# Altium schematic sheet Top.SchDoc
size A3
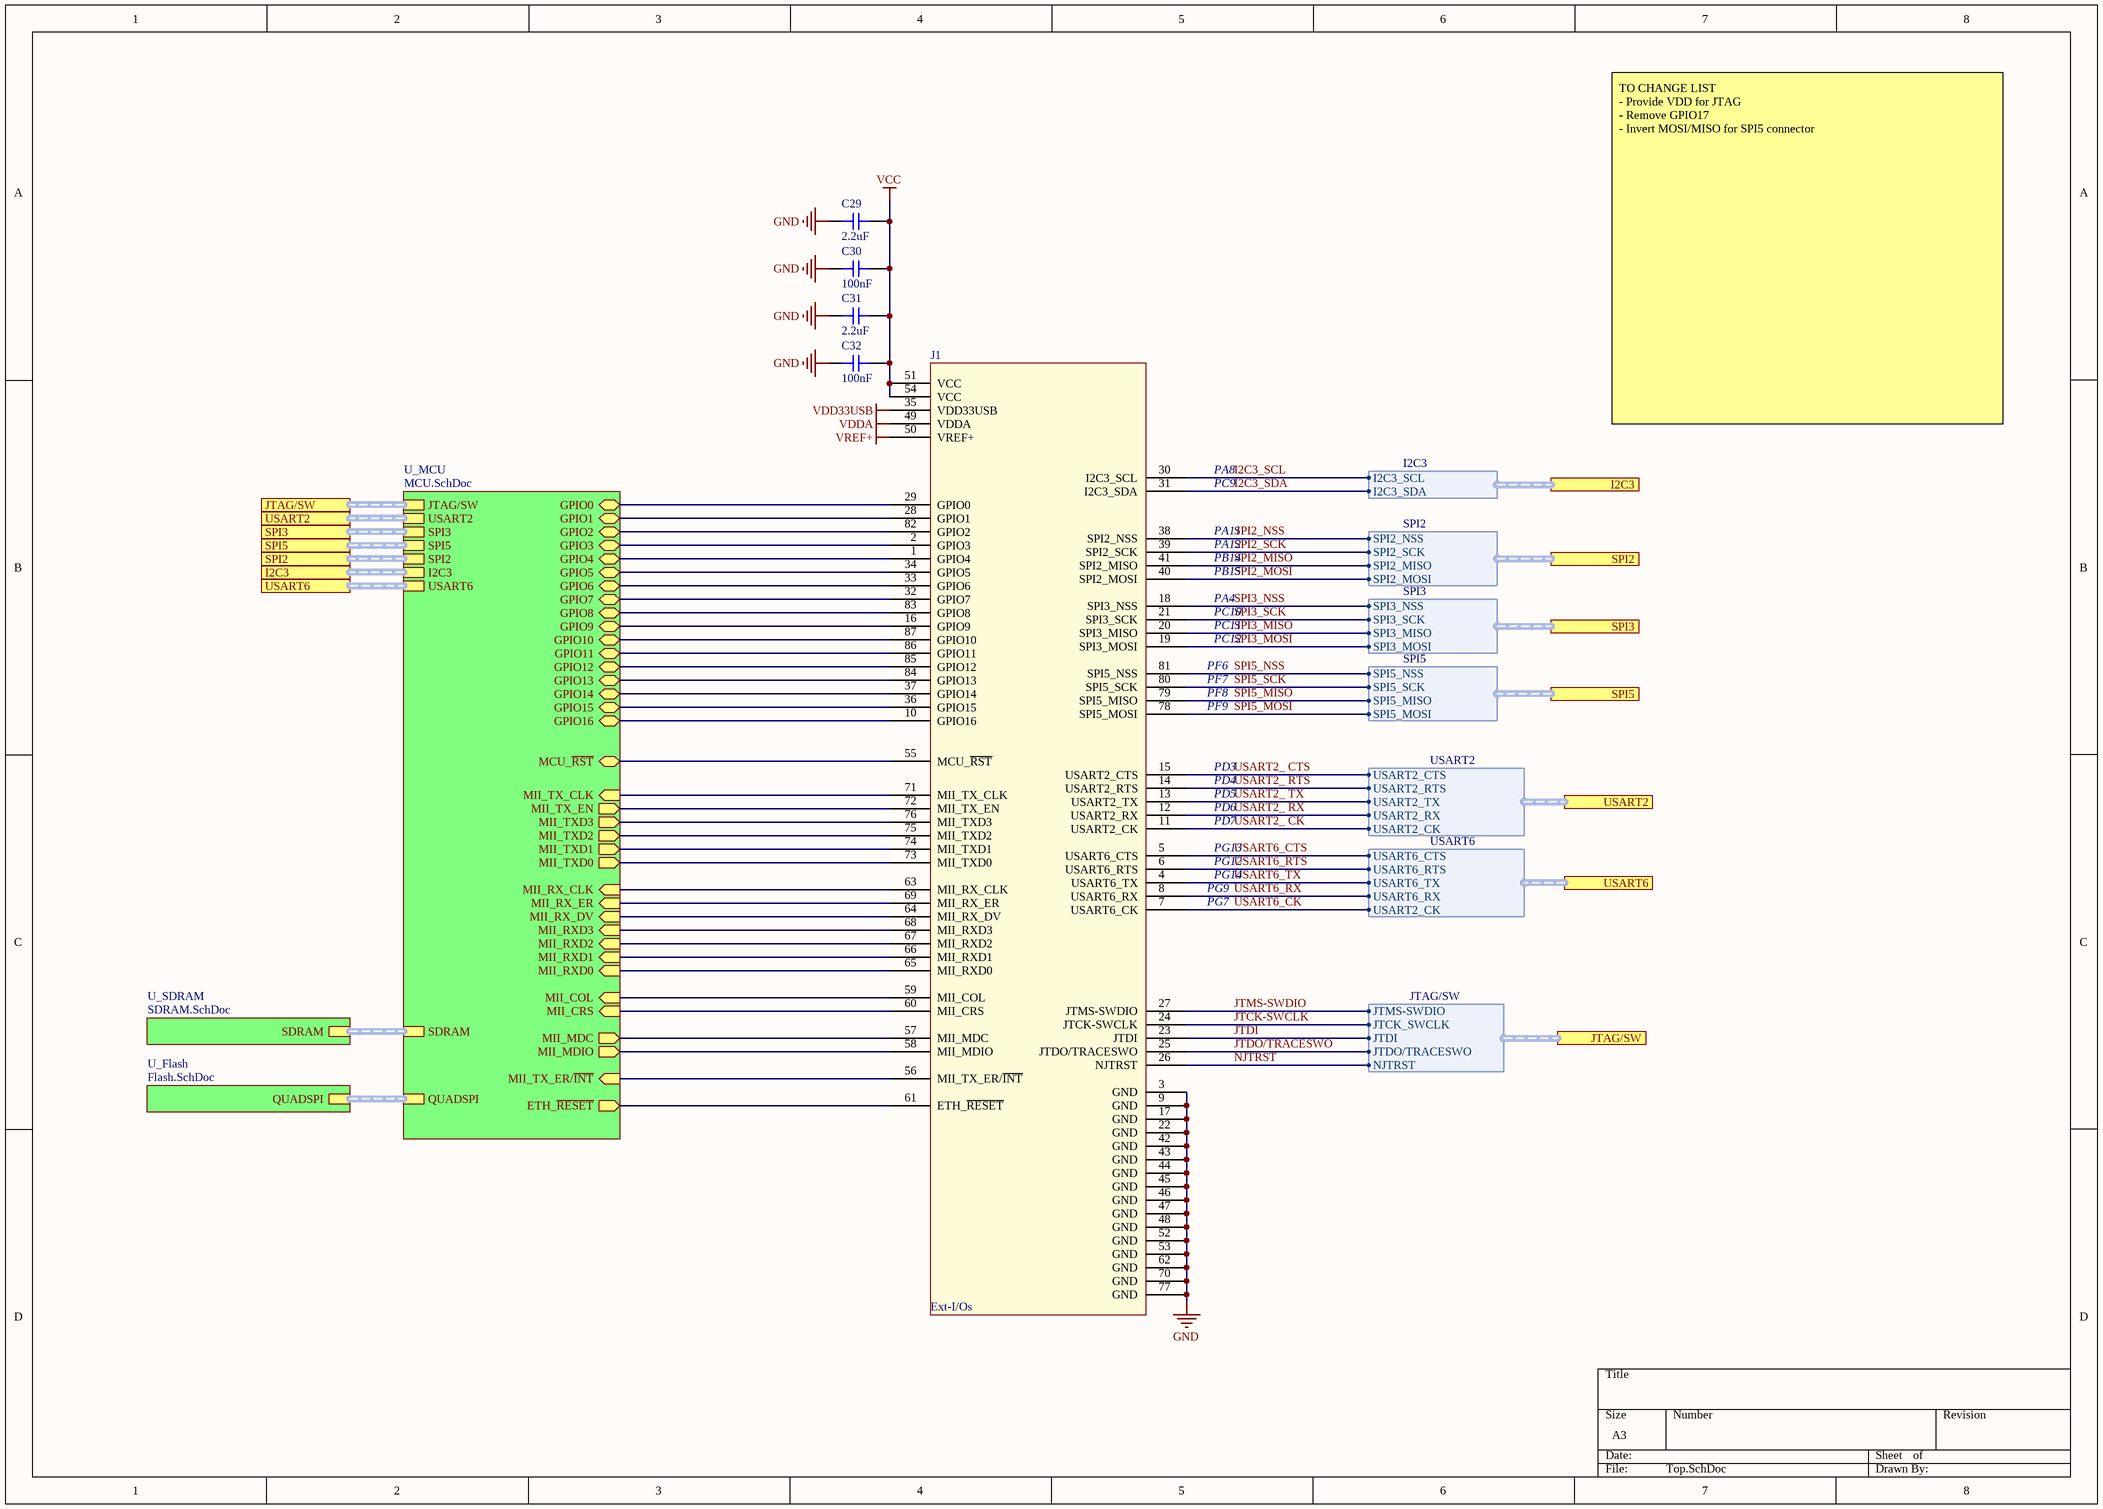
[diagram p0: Top.SchDoc]

## Parts
C29  value 2.2uF  [Capacitor-0603]  (hidden comment: C-2.2uF-0603)
C30  value 100nF  [Capacitor-0603]  (hidden comment: C-100nF-0603)
C31  value 2.2uF  [Capacitor-0603]  (hidden comment: C-2.2uF-0603)
C32  value 100nF  [Capacitor-0603]  (hidden comment: C-100nF-0603)
J1  Ext-I/Os  [EXT_IOS]

## Sub-sheets
U_Flash = Flash.SchDoc: QUADSPI (harness QUADSPI)
U_MCU = MCU.SchDoc: JTAG/SW (harness JTAG/SW), USART2 (harness USART2), SPI3 (harness SPI3), SPI5 (harness SPI5), SPI2 (harness SPI2), I2C3 (harness I2C3), USART6 (harness USART6), MII_RX_CLK (in), MII_MDIO (out), MII_CRS (in), MII_COL (in), ETH_~{RESET} (out), MII_RXD3 (in), MII_RXD2 (in), MII_RX_DV (in), MII_TX_ER/~{INT} (in), MII_RX_ER (in), MII_TX_EN (out), MII_TXD0 (out), MII_TXD1 (out), MII_TXD3 (out), MII_RXD1 (in), MII_RXD0 (in), MII_TX_CLK (in), MII_TXD2 (out), MII_MDC (out), GPIO0 (bidir), GPIO1 (bidir), GPIO2 (bidir), GPIO3 (bidir), GPIO4 (bidir), GPIO5 (bidir), GPIO6 (bidir), GPIO7 (bidir), GPIO8 (bidir), GPIO9 (bidir), GPIO10 (bidir), GPIO11 (bidir), GPIO12 (bidir), GPIO13 (bidir), GPIO14 (bidir), GPIO15 (bidir), GPIO16 (bidir), MCU_~{RST} (bidir), SDRAM (harness SDRAM), QUADSPI (harness QUADSPI)
U_SDRAM = SDRAM.SchDoc: SDRAM (harness SDRAM)

## Ports
I2C3 (harness I2C3), JTAG/SW (harness JTAG/SW), SPI2 (harness SPI2), SPI3 (harness SPI3), SPI5 (harness SPI5), USART2 (harness USART2), USART6 (harness USART6)

## Harnesses
I2C3: I2C3_SCL, I2C3_SDA
SPI3: SPI3_NSS, SPI3_SCK, SPI3_MISO, SPI3_MOSI
SPI5: SPI5_NSS, SPI5_SCK, SPI5_MISO, SPI5_MOSI
SPI2: SPI2_NSS, SPI2_SCK, SPI2_MISO, SPI2_MOSI
USART2: USART2_CTS, USART2_RTS, USART2_TX, USART2_RX, USART2_CK
USART6: USART6_CTS, USART6_RTS, USART6_TX, USART6_RX, USART2_CK
JTAG/SW: JTMS-SWDIO, JTCK_SWCLK, JTDI, JTDO/TRACESWO, NJTRST

## Nets
GND: C29.1 C30.1 C31.1 C32.1 J1.3(GND) J1.9(GND) J1.17(GND) J1.22(GND) J1.42(GND) J1.43(GND) J1.44(GND) J1.45(GND) J1.46(GND) J1.47(GND) J1.48(GND) J1.52(GND) J1.53(GND) J1.62(GND) J1.70(GND) J1.77(GND)
VCC: C29.2 C30.2 C31.2 C32.2 J1.51(VCC) J1.54(VCC)
VDD33USB: J1.35(VDD33USB)
VDDA: J1.49(VDDA)
VREF+: J1.50(VREF+)
I2C3_SCL: J1.30(I2C3_SCL) ; port I2C3.I2C3_SCL
I2C3_SDA: J1.31(I2C3_SDA) ; port I2C3.I2C3_SDA
JTCK-SWCLK: J1.24(JTCK-SWCLK) ; port JTAG/SW.JTCK_SWCLK
JTDI: J1.23(JTDI) ; port JTAG/SW.JTDI
JTDO/TRACESWO: J1.25(JTDO/TRACESWO) ; port JTAG/SW.JTDO/TRACESWO
JTMS-SWDIO: J1.27(JTMS-SWDIO) ; port JTAG/SW.JTMS-SWDIO
NJTRST: J1.26(NJTRST) ; port JTAG/SW.NJTRST
SPI2_MISO: J1.41(SPI2_MISO) ; port SPI2.SPI2_MISO
SPI2_MOSI: J1.40(SPI2_MOSI) ; port SPI2.SPI2_MOSI
SPI2_NSS: J1.38(SPI2_NSS) ; port SPI2.SPI2_NSS
SPI2_SCK: J1.39(SPI2_SCK) ; port SPI2.SPI2_SCK
SPI3_MISO: J1.20(SPI3_MISO) ; port SPI3.SPI3_MISO
SPI3_MOSI: J1.19(SPI3_MOSI) ; port SPI3.SPI3_MOSI
SPI3_NSS: J1.18(SPI3_NSS) ; port SPI3.SPI3_NSS
SPI3_SCK: J1.21(SPI3_SCK) ; port SPI3.SPI3_SCK
SPI5_MISO: J1.79(SPI5_MISO) ; port SPI5.SPI5_MISO
SPI5_MOSI: J1.78(SPI5_MOSI) ; port SPI5.SPI5_MOSI
SPI5_NSS: J1.81(SPI5_NSS) ; port SPI5.SPI5_NSS
SPI5_SCK: J1.80(SPI5_SCK) ; port SPI5.SPI5_SCK
USART2_ CK: J1.11(USART2_CK) ; port USART2.USART2_CK
USART2_ CTS: J1.15(USART2_CTS) ; port USART2.USART2_CTS
USART2_ RTS: J1.14(USART2_RTS) ; port USART2.USART2_RTS
USART2_ RX: J1.12(USART2_RX) ; port USART2.USART2_RX
USART2_ TX: J1.13(USART2_TX) ; port USART2.USART2_TX
USART6_CK: J1.7(USART6_CK) ; port USART6.USART2_CK
USART6_CTS: J1.5(USART6_CTS) ; port USART6.USART6_CTS
USART6_RTS: J1.6(USART6_RTS) ; port USART6.USART6_RTS
USART6_RX: J1.8(USART6_RX) ; port USART6.USART6_RX
USART6_TX: J1.4(USART6_TX) ; port USART6.USART6_TX
NetJ1_1: J1.1(GPIO4) ; sheet U_MCU/GPIO4
NetJ1_2: J1.2(GPIO3) ; sheet U_MCU/GPIO3
NetJ1_10: J1.10(GPIO16) ; sheet U_MCU/GPIO16
NetJ1_16: J1.16(GPIO9) ; sheet U_MCU/GPIO9
NetJ1_28: J1.28(GPIO1) ; sheet U_MCU/GPIO1
NetJ1_29: J1.29(GPIO0) ; sheet U_MCU/GPIO0
NetJ1_32: J1.32(GPIO7) ; sheet U_MCU/GPIO7
NetJ1_33: J1.33(GPIO6) ; sheet U_MCU/GPIO6
NetJ1_34: J1.34(GPIO5) ; sheet U_MCU/GPIO5
NetJ1_36: J1.36(GPIO15) ; sheet U_MCU/GPIO15
NetJ1_37: J1.37(GPIO14) ; sheet U_MCU/GPIO14
NetJ1_55: J1.55(MCU_~{RST}) ; sheet U_MCU/MCU_~{RST}
NetJ1_56: J1.56(MII_TX_ER/~{INT}) ; sheet U_MCU/MII_TX_ER/~{INT}
NetJ1_57: J1.57(MII_MDC) ; sheet U_MCU/MII_MDC
NetJ1_58: J1.58(MII_MDIO) ; sheet U_MCU/MII_MDIO
NetJ1_59: J1.59(MII_COL) ; sheet U_MCU/MII_COL
NetJ1_60: J1.60(MII_CRS) ; sheet U_MCU/MII_CRS
NetJ1_61: J1.61(ETH_~{RESET}) ; sheet U_MCU/ETH_~{RESET}
NetJ1_63: J1.63(MII_RX_CLK) ; sheet U_MCU/MII_RX_CLK
NetJ1_64: J1.64(MII_RX_DV) ; sheet U_MCU/MII_RX_DV
NetJ1_65: J1.65(MII_RXD0) ; sheet U_MCU/MII_RXD0
NetJ1_66: J1.66(MII_RXD1) ; sheet U_MCU/MII_RXD1
NetJ1_67: J1.67(MII_RXD2) ; sheet U_MCU/MII_RXD2
NetJ1_68: J1.68(MII_RXD3) ; sheet U_MCU/MII_RXD3
NetJ1_69: J1.69(MII_RX_ER) ; sheet U_MCU/MII_RX_ER
NetJ1_71: J1.71(MII_TX_CLK) ; sheet U_MCU/MII_TX_CLK
NetJ1_72: J1.72(MII_TX_EN) ; sheet U_MCU/MII_TX_EN
NetJ1_73: J1.73(MII_TXD0) ; sheet U_MCU/MII_TXD0
NetJ1_74: J1.74(MII_TXD1) ; sheet U_MCU/MII_TXD1
NetJ1_75: J1.75(MII_TXD2) ; sheet U_MCU/MII_TXD2
NetJ1_76: J1.76(MII_TXD3) ; sheet U_MCU/MII_TXD3
NetJ1_82: J1.82(GPIO2) ; sheet U_MCU/GPIO2
NetJ1_83: J1.83(GPIO8) ; sheet U_MCU/GPIO8
NetJ1_84: J1.84(GPIO13) ; sheet U_MCU/GPIO13
NetJ1_85: J1.85(GPIO12) ; sheet U_MCU/GPIO12
NetJ1_86: J1.86(GPIO11) ; sheet U_MCU/GPIO11
NetJ1_87: J1.87(GPIO10) ; sheet U_MCU/GPIO10

## Buses and harness runs
harness port I2C3 = sheet U_MCU/I2C3
harness port JTAG/SW = sheet U_MCU/JTAG/SW
harness port SPI2 = sheet U_MCU/SPI2
harness port SPI3 = sheet U_MCU/SPI3
harness port SPI5 = sheet U_MCU/SPI5
harness port USART2 = sheet U_MCU/USART2
harness port USART6 = sheet U_MCU/USART6
harness sheet U_Flash/QUADSPI = sheet U_MCU/QUADSPI
harness sheet U_MCU/SDRAM = sheet U_SDRAM/SDRAM

## Notes on the sheet
- TO CHANGE LIST
  - Provide VDD for JTAG
  - Remove GPIO17
  - Invert MOSI/MISO for SPI5 connector
- (near J1) PC9
- (near J1) PA8
- (near J1) PB14
- (near J1) PB15
- (near J1) PA11
- (near J1) PA12
- (near J1) PC10
- (near J1) PC11
- (near J1) PC12
- (near J1) PA4
- (near J1) PF6
- (near J1) PF7
- (near J1) PF8
- (near J1) PF9
- (near J1) PD3
- (near J1) PD4
- (near J1) PD5
- (near J1) PD6
- (near J1) PD7
- (near J1) PG13
- (near J1) PG9
- (near J1) PG7
- (near J1) PG12
- (near J1) PG14

## Library data of the parts
C29 C31 = C-2.2uF-0603: Supplier 1: Digi-Key; Supplier Part Number 1: 1276-1085-1-ND
C30 C32 = C-100nF-0603: Supplier 1: Digi-Key; Supplier Part Number 1: 1276-1006-1-ND